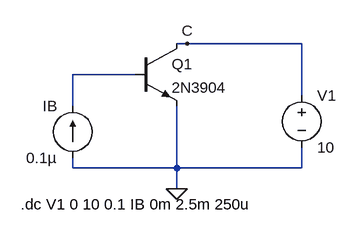
[diagram p0: schematic HLab01_BJT_xtics_C.asc]
HLab01_BJT_xtics_C.asc, the LTspice schematic file:
Version 4
SHEET 1 880 680
WIRE 208 48 192 48
WIRE 384 48 208 48
WIRE 128 96 32 96
WIRE 384 128 384 48
WIRE 32 144 32 96
WIRE 32 240 32 224
WIRE 192 240 192 144
WIRE 192 240 32 240
WIRE 384 240 384 208
WIRE 384 240 192 240
WIRE 192 272 192 240
FLAG 192 272 0
FLAG 208 48 C
SYMBOL voltage 384 112 R0
WINDOW 123 0 0 Left 0
WINDOW 39 0 0 Left 0
SYMATTR InstName V1
SYMATTR Value 10
SYMBOL npn 128 48 R0
SYMATTR InstName Q1
SYMATTR Value 2N3904
SYMBOL current 32 224 R180
WINDOW 0 24 80 Left 2
WINDOW 3 24 0 Left 2
WINDOW 123 0 0 Left 0
WINDOW 39 0 0 Left 0
SYMATTR InstName IB
SYMATTR Value 0.1µ
TEXT -48 296 Left 2 !.dc V1 0 10 0.1 IB 0m 2.5m 250u

The netlist it stands for:
* HLab01_BJT_xtics_C.asc
V1 C 0 10
Q1 C N001 0 0 2N3904
IB 0 N001 0.1µ
.model NPN NPN
.model PNP PNP
.lib standard.bjt
.dc V1 0 10 0.1 IB 0m 2.5m 250u
.backanno
.end